# EAGLE design invader_asyn_node (EAGLE 7.5.0)
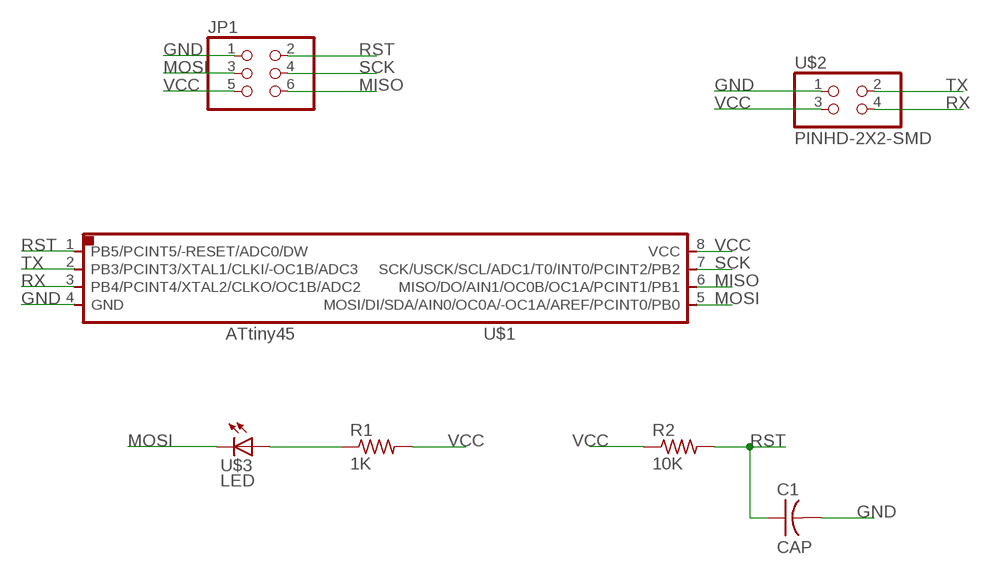
[diagram p0: schematic, sheet 1]

## Parts
C1  CAP  CAP-US1206FAB  [C1206FAB]
JP1  PINHD-2X3-SMD  [2X03SMD]
R1  1K  RES-US1206  [R1206]
R2  10K  RES-US1206  [R1206]
U$1  ATTINY45SI  [SOIC8]
U$2  PINHD-2X2-SMD  [2X02SMD]
U$3  LED  LEDFAB1206  [LED1206FAB]

## Nets
GND: C1.2 JP1.1 U$1.4(GND) U$2.1
MISO: JP1.6 U$1.6(MISO/DO/AIN1/OC0B/OC1A/PCINT1/PB1)
MOSI: JP1.3 U$1.5(MOSI/DI/SDA/AIN0/OC0A/-OC1A/AREF/PCINT0/PB0) U$3.2(C)
N$1: R1.1 U$3.1(A)
RST: C1.1 JP1.2 R2.2 U$1.1(PB5/PCINT5/-RESET/ADC0/DW)
RX: U$1.3(PB4/PCINT4/XTAL2/CLKO/OC1B/ADC2) U$2.4
SCK: JP1.4 U$1.7(SCK/USCK/SCL/ADC1/T0/INT0/PCINT2/PB2)
TX: U$1.2(PB3/PCINT3/XTAL1/CLKI/-OC1B/ADC3) U$2.2
VCC: JP1.5 R1.2 R2.1 U$1.8(VCC) U$2.3

## Library data of the parts
C1 = fab (1):CAP-US
JP1 = fab (1):PINHD-2X3-SMD: PIN HEADER
R1 R2 = fab (1):RES-US: Resistor (US Symbol) Variants with postfix FAB are widened to allow the routing of internal traces
U$1 = fab (1):ATTINY45
U$2 = fab (1):PINHD-2X2-SMD
U$3 = fab (1):LED: LED

## Board
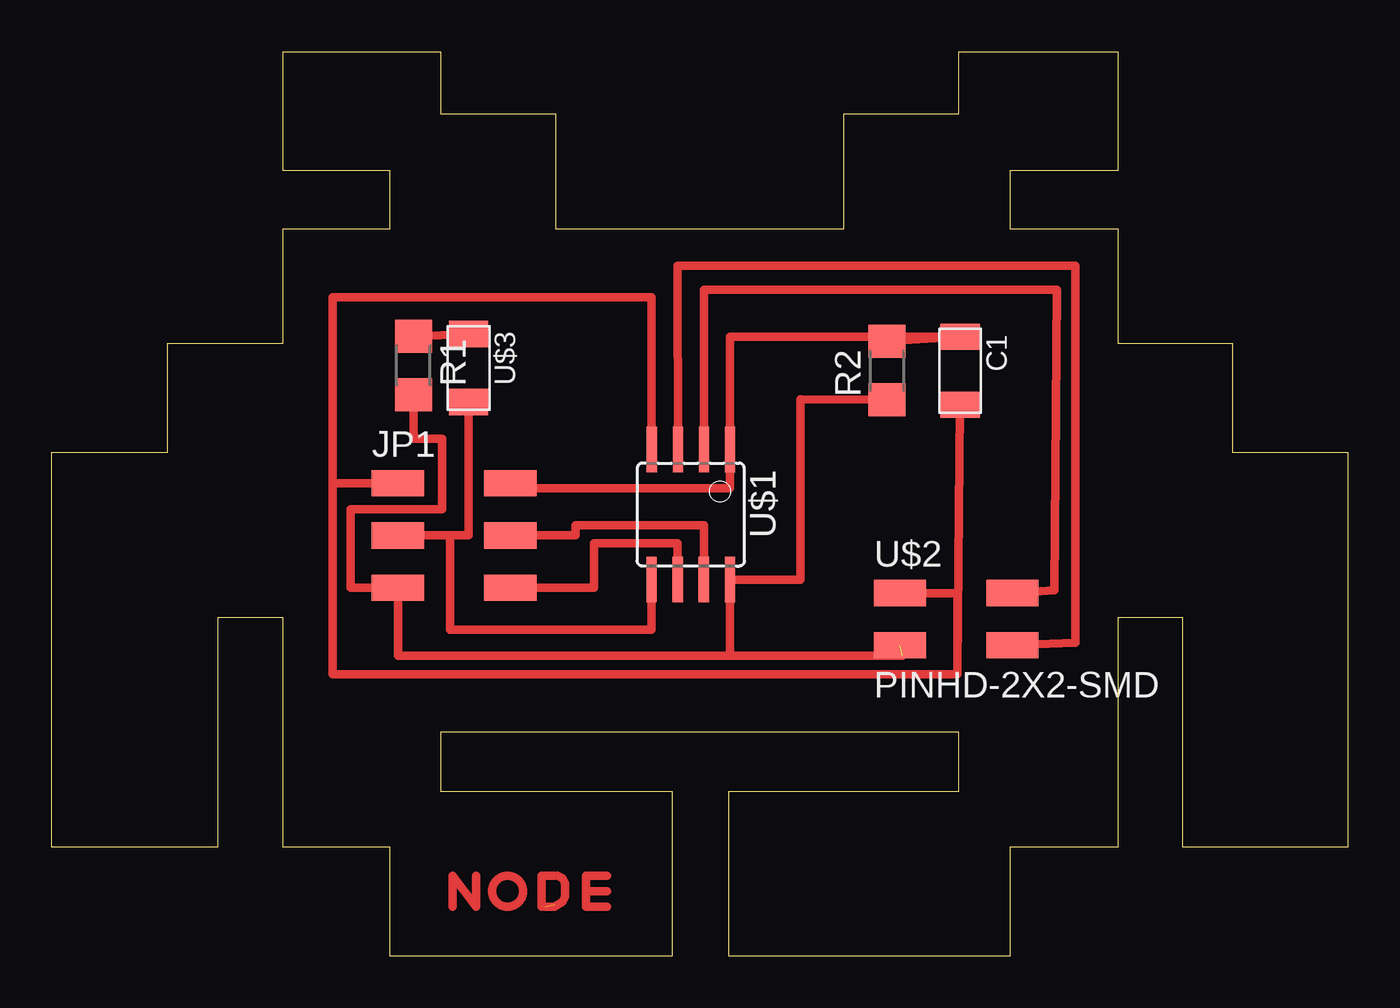
[diagram p1: board, top side]

Size 62.96 x 43.91 mm. Coordinates in mm from the lower left corner, seen from the top.
Outline: 16.45,5.27 11.24,5.27 11.24,16.41 8.06,16.41 8.06,5.27 0,5.27 0,24.45 5.65,24.45 5.65,29.75 11.24,29.75 11.24,35.31 16.45,35.31 16.45,38.13 11.24,38.13 11.24,43.91 18.89,43.91 18.89,40.89 24.48,40.89 24.48,35.31 38.48,35.31 38.48,40.89 44.07,40.89 44.07,43.91 51.78,43.91 51.78,38.13 46.55,38.13 46.55,35.31 51.78,35.31 51.78,29.75 57.34,29.75 57.34,24.45 62.96,24.45 62.96,5.27 54.93,5.27 54.93,16.41 51.78,16.41 51.78,5.27 46.55,5.27 46.55,0 32.89,0 32.89,8 44.07,8 44.07,10.86 18.89,10.86 18.89,8 30.13,8 30.13,0 16.45,0 16.45,5.27
Copper layers (1*16): Top 0.035mm / dielectric 1.5mm / Bottom 0.035mm
Design rules "default *": minimum track width 10mil, minimum drill 24mil, track to track 16mil, track to pad 16mil, pad to pad 16mil, via to via 16mil, smd to smd 16mil, copper to edge 40mil, drill to drill 8mil, minimum pad ring 10mil, minimum via ring 8mil, stop-mask expansion 4mil, vias tented up to drill 0mil, thermal gap 10mil

### Footprints (pad centres in the part's own frame; a part is rotated, then mirrored left to right if it is on the bottom)
C1206FAB = smd 1.27 x 1.905: 1 -1.651,0; 2 1.651,0
2X03SMD = smd 2.54 x 1.27: 1 -2.54,2.54; 2 2.92,2.54; 3 -2.54,0; 4 2.92,0; 5 -2.54,-2.54; 6 2.92,-2.54
R1206 = smd 1.6 x 1.803: 1 -1.422,0; 2 1.422,0
SOIC8 = smd 0.5 x 2.2: 1 -1.905,-3.154; 2 -0.645,-3.154; 3 0.625,-3.154; 4 1.895,-3.154; 5 1.905,3.154; 6 0.635,3.154; 7 -0.635,3.154; 8 -1.905,3.154
2X02SMD = smd 2.54 x 1.27: 1 -2.54,1.27; 2 2.92,1.27; 3 -2.54,-1.27; 4 2.92,-1.27
LED1206FAB = smd 1.27 x 1.905: 1 -1.651,0; 2 1.651,0

### Placement (x,y rotation side)
C1  44.13,28.42 270 top
JP1  19.36,20.42 0 top
R1  17.58,28.67 270 top
R2  40.57,28.42 90 top
U$1  31.04,21.43 180 top
U$2  43.74,16.35 0 top
U$3  20.25,28.54 270 top

### Tracks (layer width: path | path; a pad name or v marks a point on that pad's centre or on a via)
GND
  Top 0.406: 13.65,22.96 13.65,13.69 44,13.69 44,13.94 | 44,13.94 44,17.62 41.71,17.62 | 41.71,17.62 41.71,17.37 | C1.2 44.13,26.64 44,13.94 | 41.71,17.62 U$2.1 | JP1.1 13.65,22.96 | 13.65,22.96 13.65,31.97 29.14,31.97 U$1.4
MISO
  Top 0.406: JP1.6 26.35,17.88 26.35,20.04 30.41,20.04 U$1.6
MOSI
  Top 0.406: JP1.3 19.36,20.42 | 19.36,20.42 20.25,20.42 U$3.2 | U$1.5 29.14,15.84 19.36,15.84 19.36,20.42
N$1
  Top 0.406: U$3.1 R1.1
N$2
  Top 0.001: 25.84,3.78 25.84,3.91 25.96,3.78
N$3
  Top 0.406: 25.96,3.91 25.96,2.38 26.98,2.38
N$4
  Top 0.406: 26.09,3.14 26.98,3.14
N$5
  Top 0.406: 26.09,3.91 26.98,3.91
N$6
  Top 0.406: 19.49,2.38 19.49,3.91
N$7
  Top 0.406: 19.49,3.91 20.63,2.38 20.63,3.91
N$8
  Top 0.406: 23.81,3.91 23.81,2.38
N$9
  Top 0.406: 23.93,3.91 24.44,3.91
N$10  (1 unrouted)
N$11
  Top 0.406: 23.93,2.38 24.44,2.38 24.82,2.64 24.95,2.89 24.95,3.53 24.82,3.78 24.57,3.91
RST
  Top 0.406: R2.2 C1.1 32.95,30.07 U$1.1 32.95,22.7 22.53,22.7 arc-90 JP1.2
RX
  Top 0.406: U$2.4 46.54,15.08 49.71,15.21 49.71,33.5 30.41,33.5 U$1.3
SCK
  Top 0.406: JP1.4 25.46,20.42 25.46,20.92 31.68,20.92 U$1.7
TX
  Top 0.406: U$2.2 48.7,17.75 48.82,32.35 31.68,32.35 U$1.2
VCC  (1 unrouted)
  Top 0.406: 32.95,14.57 16.82,14.57 JP1.5 14.53,17.88 14.53,21.69 18.98,21.69 18.98,25.12 17.58,25.12 R1.2 | 41.33,14.57 32.95,14.57 | 32.95,14.57 U$1.8 36.38,18.26 36.38,27.02 R2.1
(copper drawn outside any net)
  shapes: Top circle x1